# EAGLE design Digital (EAGLE 7.1.0)
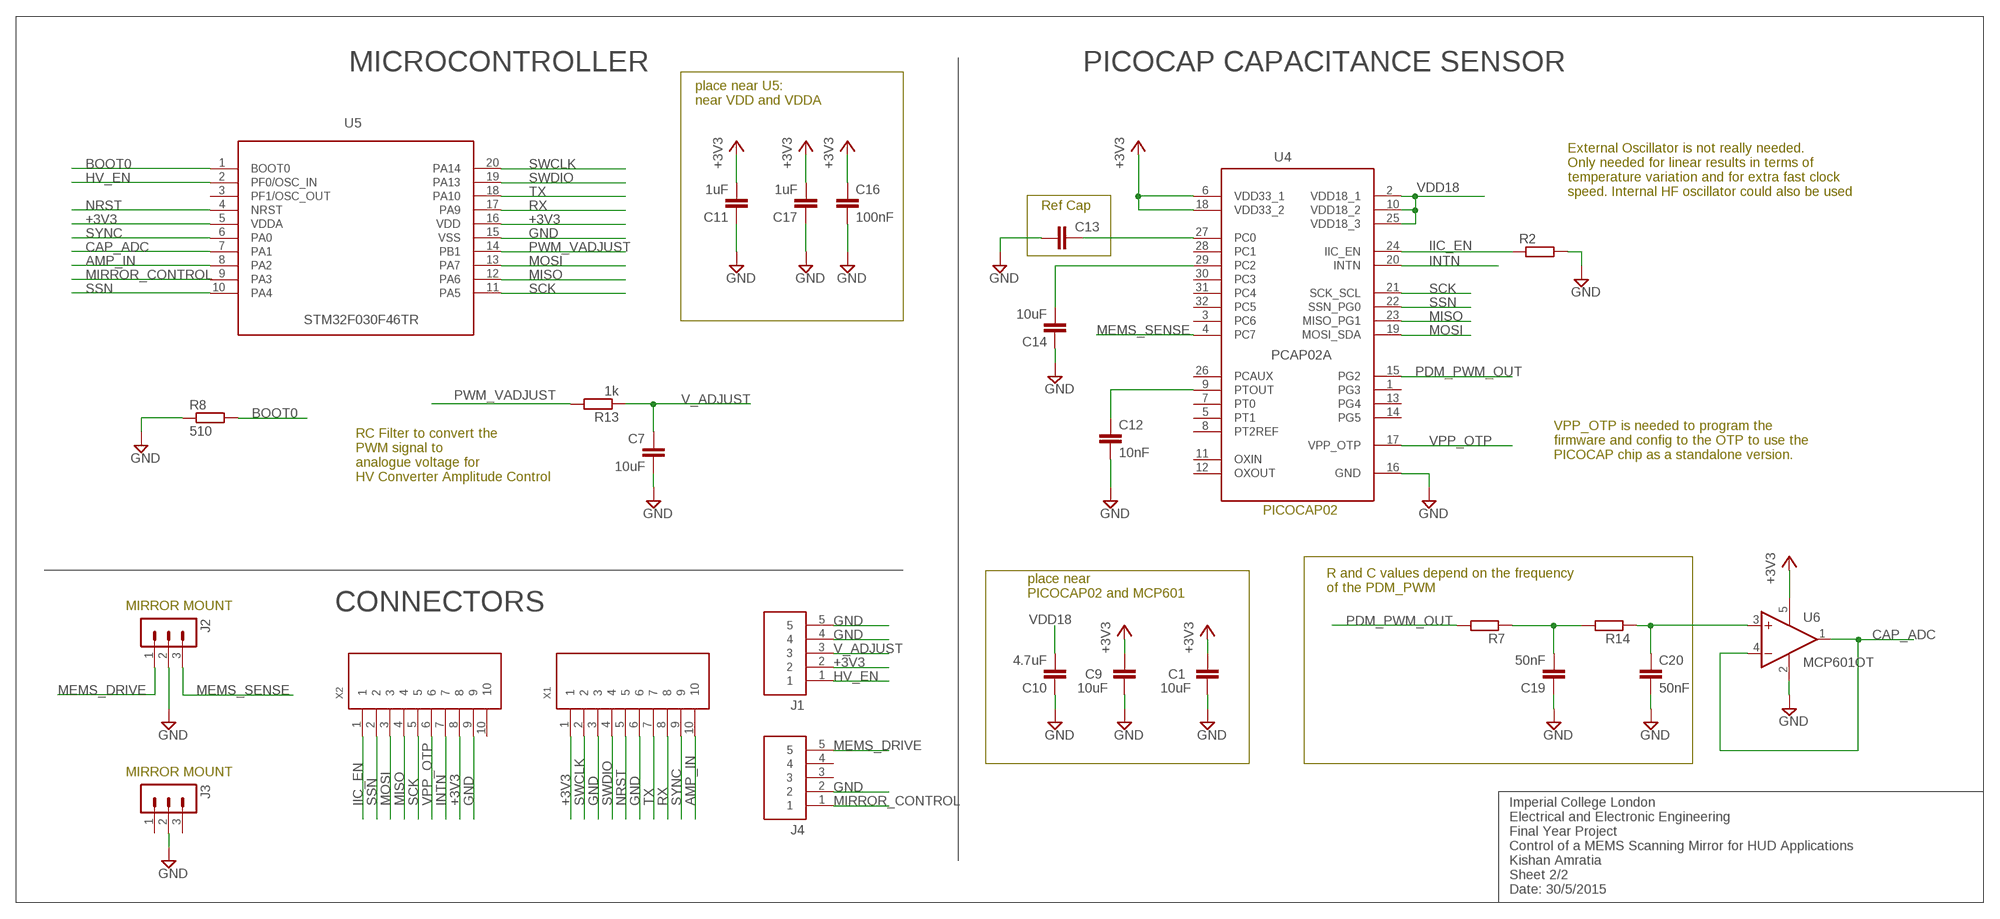
[diagram p0: schematic, sheet 1]

## Parts
C1  10uF  C-EUC0603K  [C0603K]
C7  10uF  C-EUC0603  [C0603]
C9  10uF  C-EUC0603K  [C0603K]
C10  4.7uF  C-EUC0603K  [C0603K]
C11  1uF  C-EUC0603K  [C0603K]
C12  10nF  C-EUC0603K  [C0603K]
C13  C-EUC0603K  [C0603K]
C14  10uF  C-EUC0603K  [C0603K]
C16  100nF  C-EUC0603K  [C0603K]
C17  1uF  C-EUC0603K  [C0603K]
C19  50nF  C-EUC0603K  [C0603K]
C20  50nF  C-EUC0603K  [C0603K]
J1  1.27MM_5WAY_HEADER  [1.27MM_5WAY_HEADER]
J2  MA03-1  [MA03-1]
J3  MA03-1  [MA03-1]
J4  1.27MM_5WAY_HEADER  [1.27MM_5WAY_HEADER]
R2  R-EU_R0603  [R0603]
R7  R-EU_R0603  [R0603]
R8  510  R-EU_R0603  [R0603]
R13  1k  R-EU_R0603  [R0603]
R14  R-EU_R0603  [R0603]
U4  PCAP02A  [QFN32]
U5  STM32F030XX  [TSOP20]
U6  MCP601OT  [SOT23-5]
X1  OMRON_FPC_0.5MM_10WAY  [OMRON_FPC_0.5MM_10WAY]
X2  OMRON_FPC_0.5MM_10WAY  [OMRON_FPC_0.5MM_10WAY]

## Nets
+3V3: C1.1 C9.1 C11.2 C16.1 C17.2 J1.2 U4.6(VDD33_1) U4.18(VDD33_2) U5.5(VDDA) U5.16(VDD) U6.5(V+) X1.1 X2.8
AMP_IN: U5.8(PA2) X1.10
BOOT0: R8.2 U5.1(BOOT0)
CAP_ADC: U5.7(PA1) U6.1(OUT) U6.4(-IN)
GND: C1.2 C7.2 C9.2 C10.1 C11.1 C12.2 C13.1 C14.1 C16.2 C17.1 C19.1 C20.2 J1.4 J1.5 J2.2 J3.2 J4.2 R2.2 R8.1 U4.16(GND) U5.15(VSS) U6.2(V-) X1.3 X1.6 X2.9
HV_EN: J1.1 U5.2(PF0/OSC_IN)
IIC_EN: R2.1 U4.24(IIC_EN) X2.1
INTN: U4.20(INTN) X2.7
MEMS_DRIVE: J2.1 J4.5
MEMS_SENSE: J2.3 U4.4(PC7)
MIRROR_CONTROL: J4.1 U5.9(PA3)
MISO: U4.23(MISO_PG1) U5.12(PA6) X2.4
MOSI: U4.19(MOSI_SDA) U5.13(PA7) X2.3
N$2: C19.2 R7.1 R14.2
N$11: C12.1 U4.9(PTOUT)
N$17: C13.2 U4.27(PC0)
N$18: C14.2 U4.29(PC2)
NRST: U5.4(NRST) X1.5
PDM: C20.1 R14.1 U6.3(+IN)
PDM_PWM_OUT: R7.2 U4.15(PG2)
PWM_VADJUST: R13.2 U5.14(PB1)
RX: U5.17(PA9) X1.8
SCK: U4.21(SCK_SCL) U5.11(PA5) X2.5
SSN: U4.22(SSN_PG0) U5.10(PA4) X2.2
SWCLK: U5.20(PA14) X1.2
SWDIO: U5.19(PA13) X1.4
SYNC: U5.6(PA0) X1.9
TX: U5.18(PA10) X1.7
V_ADJUST: C7.1 J1.3 R13.1
VDD18: C10.2 U4.2(VDD18_1) U4.10(VDD18_2) U4.25(VDD18_3)
VPP_OTP: U4.17(VPP_OTP) X2.6
Unconnected: J3.1 J3.3 J4.3 J4.4 U4.1(PG3) U4.3(PC6) U4.5(PT1) U4.7(PT0) U4.8(PT2REF) U4.11(OXIN) U4.12(OXOUT) U4.13(PG4) U4.14(PG5) U4.26(PCAUX) U4.28(PC1) U4.30(PC3) U4.31(PC4) U4.32(PC5) U5.3(PF1/OSC_OUT) X2.10

## Notes on the sheet
- MICROCONTROLLER | PICOCAP CAPACITANCE SENSOR
- place near U5:
  near VDD and VDDA
- External Oscillator is not really needed.
  Only needed for linear results in terms of
  temperature variation and for extra fast clock
  speed. Internal HF oscillator could also be used
- Ref Cap
- VPP_OTP is needed to program the
  firmware and config to the OTP to use the
  PICOCAP chip as a standalone version.
- RC Filter to convert the 
  PWM signal to
  analogue voltage for
  HV Converter Amplitude Control
- PICOCAP02
- R and C values depend on the frequency 
  of the PDM_PWM
- place near 
  PICOCAP02 and MCP601
- MIRROR MOUNT | CONNECTORS
- MIRROR MOUNT
- Imperial College London
  Electrical and Electronic Engineering
  Final Year Project
  Control of a MEMS Scanning Mirror for HUD Applications
  Kishan Amratia
  Sheet 2/2
  Date: 30/5/2015

## Library data of the parts
C1 C7 C9-C14 C16 C17 C19 C20 = rcl:C-EU: CAPACITOR, European symbol
J1 J4 = FYP:1.27MM_5WAY_HEADER
J2 J3 = con-lstb:MA03-1: PIN HEADER; OC_FARNELL: unknown; OC_NEWARK: unknown
R2 R7 R8 R13 R14 = rcl:R-EU_: RESISTOR, European symbol
U4 = FYP:PCAP02A
U5 = FYP:STM32F030XX
U6 = linear:MCP601: Single Op Amp 2.7V to 6.0V Single Supply CMOS Source: http://ww1.microchip.com/downloads/en/DeviceDoc/21314g.pdf
X1 X2 = FYP:OMRON_FPC_0.5MM_10WAY

## Board
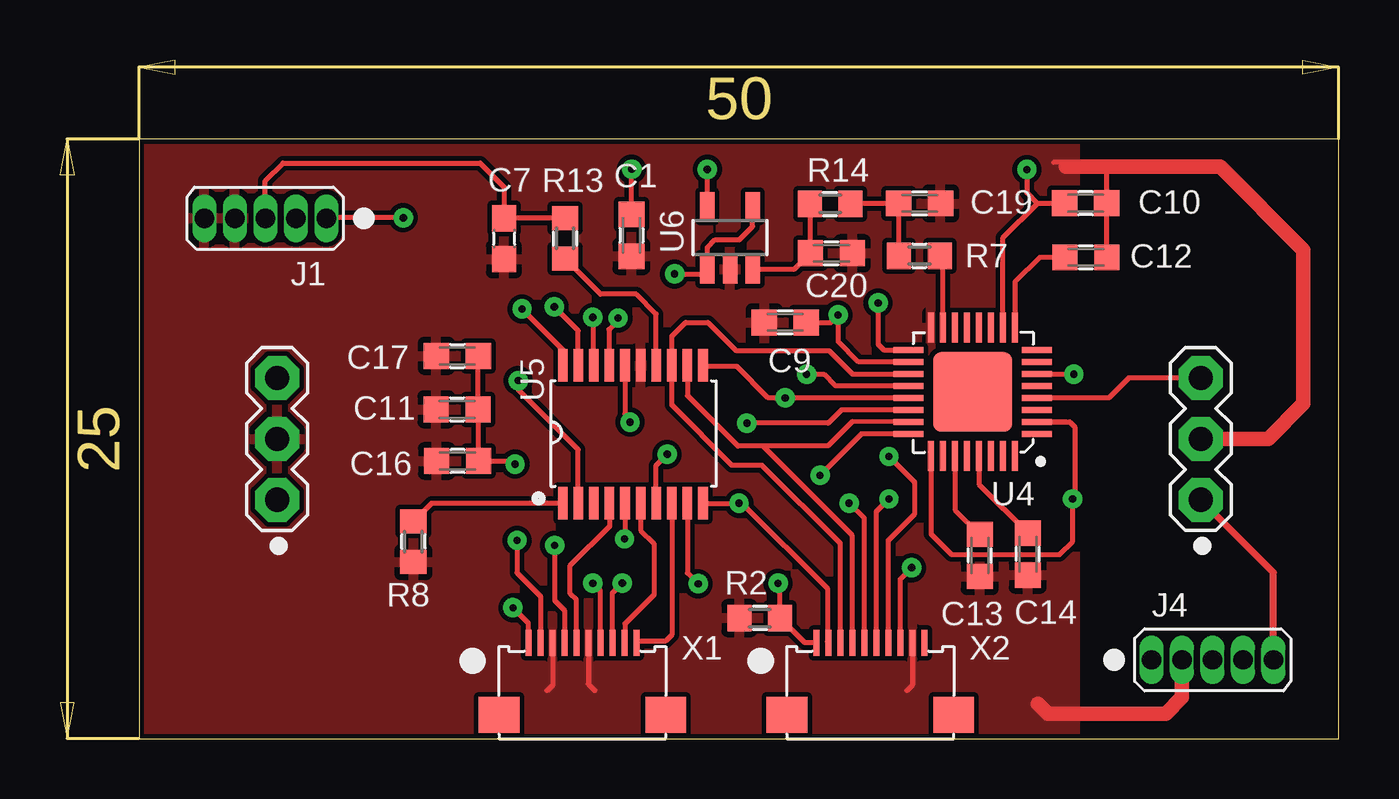
[diagram p1: board, top side]
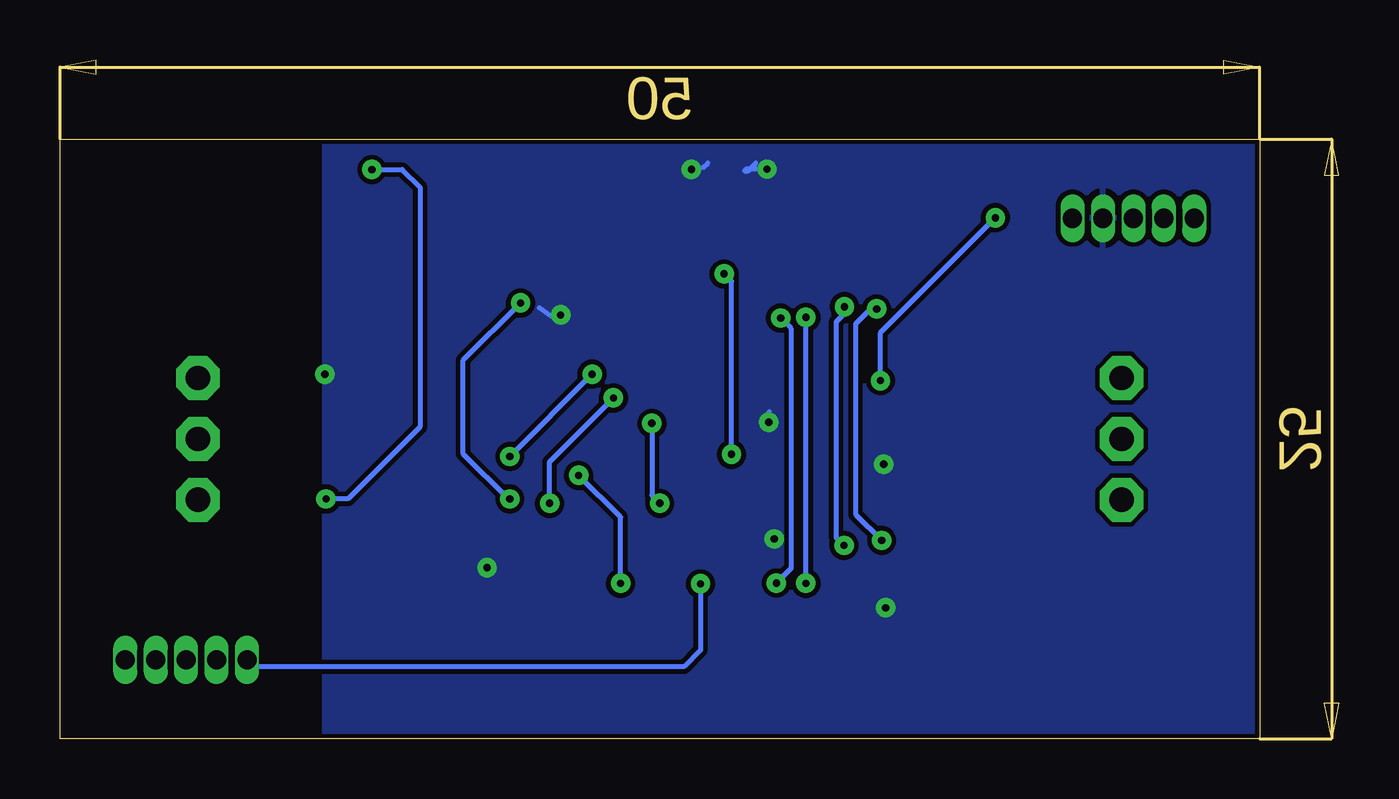
[diagram p2: board, bottom side, seen from below]

Size 50 x 25 mm. Coordinates in mm from the lower left corner, seen from the top.
Outline: 0,0 50,0 50,25 0,25 0,0
Copper layers (1*16): Top 0.035mm / dielectric 1.5mm / Bottom 0.035mm
Design rules "pcbtrain *": minimum track width 0.2mm, minimum drill 0.2mm, track to track 0.2mm, track to pad 0.2mm, pad to pad 0.2mm, via to via 0.2mm, smd to smd 0mil, copper to edge 0.2mm, drill to drill 0.2mm, minimum pad ring 4mil, minimum via ring 10mil, stop-mask expansion 0.125mm, vias tented up to drill 0mil, thermal gap 10mil

### Footprints (pad centres in the part's own frame; a part is rotated, then mirrored left to right if it is on the bottom)
C0603K = smd 1.05 x 1.08: 1 -0.875,0; 2 0.875,0
C0603 = smd 1.1 x 1: 1 -0.85,0; 2 0.85,0
1.27MM_5WAY_HEADER = drill 0.8 pad 1 long: 1 0,0; 2 1.27,0; 3 2.54,0; 4 3.81,0; 5 5.08,0
MA03-1 = drill 1.016 pad 1.829 octagon: 1 -2.54,0; 2 0,0; 3 2.54,0
R0603 = smd 1 x 1.1: 1 -0.85,0; 2 0.85,0
QFN32 = smd 0.25 x 1.25: 1 0,-0.245; 2 0.5,-0.245; 3 1,-0.245; 4 1.5,-0.245; 5 2,-0.245; 6 2.5,-0.245; 7 3,-0.245; 8 3.5,-0.245; 17 3.5,5.1; 18 3,5.1; 19 2.5,5.1; 20 2,5.1; 21 1.5,5.1; 22 1,5.1; 23 0.5,5.1; 24 0,5.1 | smd 1.25 x 0.25: 9 4.43,0.66; 10 4.43,1.16; 11 4.43,1.66; 12 4.43,2.16; 13 4.43,2.66; 14 4.43,3.16; 15 4.43,3.66; 16 4.43,4.16; 25 -0.92,4.16; 26 -0.92,3.66; 27 -0.92,3.16; 28 -0.92,2.66; 29 -0.92,2.16; 30 -0.92,1.66; 31 -0.92,1.16; 32 -0.92,0.66 | smd 3.3 x 3.3: P$33 1.75,2.43
TSOP20 = smd 0.4 x 1.35: 1 0,0; 2 0.65,0; 3 1.3,0; 4 1.95,0; 5 2.6,0; 6 3.25,0; 7 3.9,0; 8 4.55,0; 9 5.2,0; 10 5.85,0; 11 5.85,5.75; 12 5.2,5.75; 13 4.55,5.75; 14 3.9,5.75; 15 3.25,5.75; 16 2.6,5.75; 17 1.95,5.75; 18 1.3,5.75; 19 0.65,5.75; 20 0,5.75
SOT23-5 = smd 0.6 x 1.2: 1 -0.95,-1.306; 2 0,-1.306; 3 0.95,-1.306; 4 0.95,1.306; 5 -0.95,1.306
OMRON_FPC_0.5MM_10WAY = smd 0.25 x 1.1: 1 1.225,3; 2 1.725,3; 3 2.225,3; 4 2.725,3; 5 3.225,3; 6 3.725,3; 7 4.225,3; 8 4.725,3; 9 5.225,3; 10 5.725,3 | smd 1.7 x 1.5: P$1 0,0; P$2 6.95,0

### Placement (x,y rotation side)
C1  20.52,20.99 270 top
C7  15.21,20.85 270 top
C9  26.93,17.36 180 top
C10  39.45,22.33 180 top
C11  13.25,13.73 0 top
C12  39.46,20.07 0 top
C13  35.04,7.64 90 top
C14  37.04,7.7 90 top
C16  13.27,11.58 180 top
C17  13.26,15.96 0 top
C19  32.53,22.32 180 top
C20  28.85,20.24 0 top
J1  7.8,21.7 180 top
J2  44.25,12.5 90 top
J3  5.75,12.5 90 top
J4  42.2,3.29 0 top
R2  25.87,5.03 180 top
R7  32.52,20.14 0 top
R8  11.43,8.22 90 top
R13  17.75,20.86 270 top
R14  28.8,22.3 0 top
U4  37.17,12.71 90 top
U5  17.65,9.82 0 top
U6  24.63,20.89 0 top
X1  15,1 0 top
X2  27,1 0 top

### Tracks (layer width: path | path; a pad name or v marks a point on that pad's centre or on a via)
+3V3  (via drill 0.3)
  Top 0.2: U6.5 v23.68,23.74 | C1.1 v20.52,23.74 v20.53,23.75 | U5.16 20.25,13.55 v20.46,13.2 | U5.5 20.25,8.35 v20.23,8.33 | X1.1 16.23,4.82 v15.58,5.46 | C17.2 C11.2 14.14,13.71 C16.1 15.54,11.58 v15.67,11.45 | U4.6 v38.95,15.21 v38.96,15.2 | X2.8 31.73,6.66 v32.2,7.13 | U4.18 29.99,15.71 29.14,16.56 v29.14,17.66 v29.13,17.67 28.8,17.34 27.82,17.34 C9.1
  Bottom 0.2: v23.68,23.74 23.17,23.83 23,24 | v20.53,23.75 21.38,23.75 21.46,23.67 21.33,23.67 21,24 | v20.46,13.2 20.42,13.31 20.44,13.63 | v20.23,8.33 20.23,8.16 20.24,8.15 | v15.58,5.46 15.42,5.46 15.41,5.47 | v38.96,15.2 38.96,15.4 38.98,15.42 | v29.13,17.67 29.51,17.61 30.03,17.97 | v32.2,7.13 32.2,7.39 32.25,7.44
  pour Bottom: 0,25 39,25 39,0 0,0
AMP_IN
  Top 0.2: U5.8 22.2,4.34 21.93,4.07 20.8,4.07 X1.10
BOOT0
  Top 0.2: U5.1 12.18,9.82 R8.2
CAP_ADC  (via drill 0.3)
  Top 0.2: U6.4 25.57,22.19 25.57,21.36 25.02,20.81 24.01,20.81 23.68,20.48 U6.1 23.48,19.38 v22.32,19.38 | U5.7 21.55,11.4 v22.01,11.86
  Bottom 0.2: v22.01,11.86 22.01,19.07 v22.32,19.38
GND
  Top 0.2: C12.2 C10.1 40.33,23.64 39.93,24.03 38.11,24.03 | X1.3 17.23,2.23 17,2 | X1.6 18.73,2.27 19,2 | X2.9 32.23,2.23 32,2
  Top 0.6: J2.2 47.06,12.5 48.53,13.97 48.53,20.38 45.06,23.85 38.62,23.85 | J4.2 43.47,1.73 42.79,1.05 37.88,1.05 37.47,1.46
  pour Top: 0,25 39,25 39,0 0,0
HV_EN  (via drill 0.3)
  Top 0.2: U5.2 18.3,12.06 15.8,14.56 v15.8,14.93 | v11.01,21.72 7.82,21.72 J1.1
  Bottom 0.2: v15.8,14.93 15.8,16.93 v11.01,21.72
IIC_EN  (via drill 0.3)
  Top 0.2: X2.1 27.75,4 R2.1 26.72,6.39 v26.63,6.48 | U4.24 30.1,12.71 v28.38,10.98
  Bottom 0.2: v26.63,6.48 26.63,9.24 v28.38,10.98
INTN  (via drill 0.3)
  Top 0.2: U4.20 29.03,14.71 28.54,15.2 v27.82,15.2 | X2.7 31.23,8.28 32.33,9.38 32.33,10.69 v31.25,11.77
  Bottom 0.2: v31.25,11.77 v27.82,15.2
MEMS_DRIVE
  Top 0.3: J4.5 47.28,6.93 J2.1
MEMS_SENSE
  Top 0.2: J2.3 41.25,15.04 40.42,14.21 U4.4
MIRROR_CONTROL  (via drill 0.3)
  Top 0.2: U5.9 22.85,6.91 v23.3,6.46
  Bottom 0.2: v23.3,6.46 23.3,3.7 24,3 41.91,3 J4.1
MISO
  Top 0.2: U5.12 22.85,14.31 24.96,12.2 26,12.2 | U4.23 29.73,13.22 28.72,12.21 26,12.2 | X2.4 29.73,8.47 26,12.2
MOSI
  Top 0.2: U4.19 29.74,15.2 28.76,16.18 24.87,16.19 23.7,17.36 22.78,17.36 22.2,16.78 U5.13 22.2,13.91 24.71,11.4 25.97,11.4 29.23,8.14 X2.3
N$2
  Top 0.2: R7.1 31.67,22.3 C19.2 29.67,22.32 R14.2
N$11
  Top 0.2: C12.1 37.54,20.07 36.51,19.04 U4.9
N$17
  Top 0.2: U4.27 34.01,9.54 C13.2
N$18
  Top 0.2: U4.29 35.01,10.61 C14.2
NRST
  Top 0.2: U5.4 19.62,9.8 19.62,8.87 17.97,7.22 17.97,6.05 18.23,5.79 X1.5
PDM
  Top 0.2: R14.1 27.95,20.27 C20.1 27.32,19.58 U6.3
PDM_PWM_OUT
  Top 0.2: U4.15 33.51,20 R7.2
PWM_VADJUST
  Top 0.2: U5.14 21.55,17.71 20.73,18.53 19.23,18.53 R13.2
RX  (via drill 0.3)
  Top 0.2: X1.8 19.73,6.08 v20.14,6.49 | v19.96,17.54 19.96,17.45 19.58,17.07 19.58,15.59 U5.17
  Bottom 0.2: v20.14,6.49 v20.14,6.5 19.52,7.12 19.52,17.1 v19.96,17.54
SCK  (via drill 0.3)
  Top 0.2: U4.21 v26.93,14.21 26.22,14.21 24.91,15.52 23.55,15.52 U5.11 | X2.5 30.23,9.2 v29.59,9.82
  Bottom 0.2: 26.89,13.93 v26.93,14.21 29.59,11.55 v29.59,9.82
SSN  (via drill 0.3)
  Top 0.2: U5.10 v25,9.82 25.13,9.82 28.68,6.27 28.68,4.04 X2.2 | U4.22 29.28,13.71 28.73,13.16 v25.34,13.16 v25.33,13.15
  Bottom 0.2: v25.33,13.15 25.33,10.15 v25,9.82
SWCLK  (via drill 0.3)
  Top 0.2: U5.20 17.65,16.23 v15.96,17.92 | v15.75,8.27 15.75,6.92 16.73,5.94 X1.2
  Bottom 0.2: v15.96,17.92 16.21,17.92 16.84,17.29 16.84,9.36 v15.75,8.27
SWDIO  (via drill 0.3)
  Top 0.2: U5.19 18.3,17.01 v17.3,18.01 | 17.7,4.03 X1.4 17.73,5.35 17.32,5.76 v17.32,8.06
  Bottom 0.2: v17.3,18.01 17.3,17.73 17.65,17.38 17.65,8.39 v17.32,8.06
SYNC
  Top 0.2: U5.6 20.9,8.69 21.45,8.14 21.45,5.99 20.25,4.79 20.25,4.03 X1.9
TX  (via drill 0.3)
  Top 0.2: X1.7 19.23,6.17 v18.91,6.48 | v18.91,17.57 18.91,15.61 U5.18
  Bottom 0.2: v18.91,6.48 v18.91,17.57
V_ADJUST
  Top 0.2: R13.1 C7.1 | J1.3 5.26,23.26 6,24 14.22,24 15.22,23 C7.1 | C7.1
VDD18  (via drill 0.3)
  Top 0.2: 37.44,22.32 37.45,22.33 37.46,22.33 | 38.56,22.33 C10.2 | U4.25 33.01,8.53 33.86,7.68 38.36,7.68 38.91,8.23 v38.91,10 39,10.09 39,13 38.79,13.21 U4.2 38.63,13.21 | U4.10 36.01,20.89 37.44,22.32 | 37.44,22.32 37.45,22.32 37.46,22.33 | 37.46,22.33 38.56,22.33 | 38.56,22.33 38.6,22.29 | v37,23.73 37,22.76 37.44,22.32
  Bottom 0.2: v37,23.73 35.73,23.73 35,23 35,13 38,10 v38.91,10
VPP_OTP  (via drill 0.3)
  Top 0.2: X2.6 30.73,9.47 v31.25,10 | v30.8,18.17 30.8,16.45 31.04,16.21 U4.17
  Bottom 0.2: 30.73,18.1 v30.8,18.17 33.19,15.78 33.19,11.88 31.31,10 v31.25,10